# Altium project PCB_Project.PrjPcb
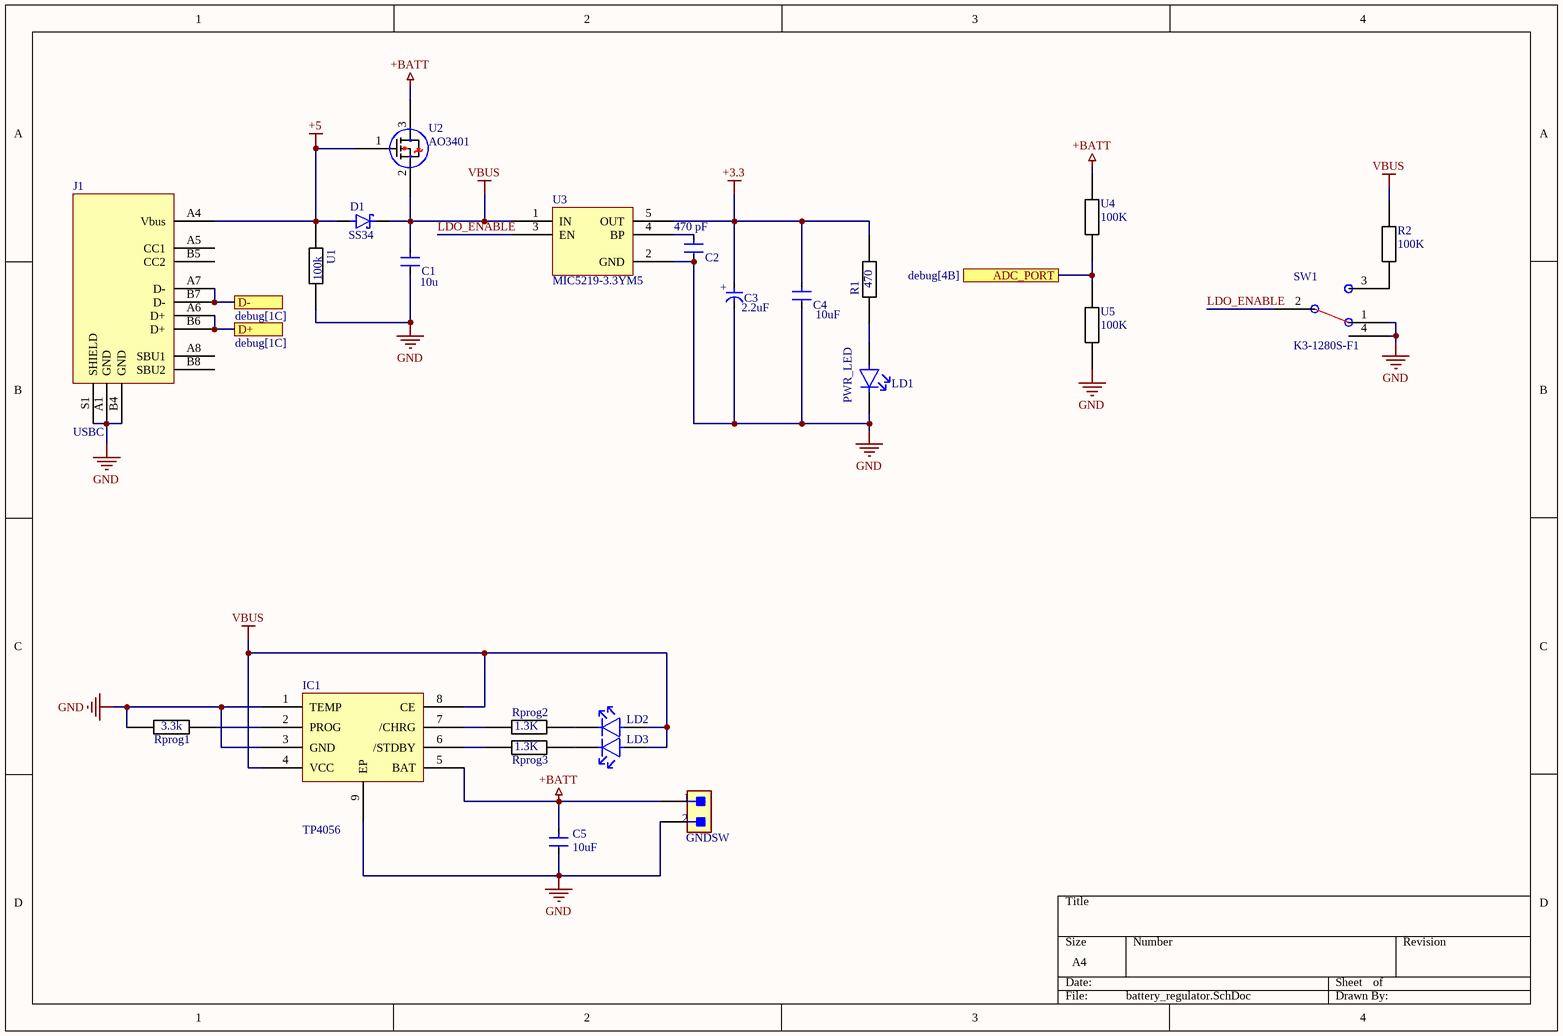
[diagram p0: battery_regulator.SchDoc]
1 sheet, 23 parts. Net scope: flat (ports and power ports of the same name join across sheets).
Board file: PCB_drone.PcbDoc

## Sheet battery_regulator.SchDoc
size A4; SheetNumber: 1; SheetTotal: 3

### Parts
C1  10u  [res0805ph]
C2  470 pF  [res0805ph]
C3  2.2uF  [res0805ph]
C4  10uF  [res0805ph]
C5  10uF  [res0805ph]
D1  SS34  [DIOM7959X265N]
GNDSW  TMM-102-02-L-S  [JST_B2B-XH-A_(LF)(SN)]  (value not drawn)
IC1  TP4056  [SOP127P600X175-9N]
J1  USBC  [SHENZHEN-CHUANGQIN-TECHNOLOGY_CQ-USB-C16PSMT01]
LD1  PWR_LED  [res0805ph]
LD2  APT1608ZGCK  [res0805ph]  (value not drawn)
LD3  APT1608ZGCK  [res0805ph]  (value not drawn)
R1  470  [res0805ph]
R2  100K  [res0805ph]
Rprog1  3.3k  [res0805ph]
Rprog2  1.3K  [res0805ph]
Rprog3  1.3K  [res0805ph]
SW1  K3-1280S-F1  [SW-SMD_K3-1280S-K1]
U1  100k  [res0805ph]
U2  AO3401  [SOT23-3]
U3  MIC5219-3.3YM5  [FP-SOT23-5LD-PL-1-IPC_C]
U4  100K  [res0805ph]
U5  100K  [res0805ph]

### Ports
ADC_PORT (see debug[4B]), D+ (see debug[1C]), D- (see debug[1C])

### Nets
+3.3: C3.2(A) C4.1 R1.2 U3.5(OUT)
+5: D1.A J1.A4(Vbus) U1.2 U2.1
+BATT: C5.1 GNDSW.1 IC1.5(BAT) U2.3 U4.1
GND: C1.2 C2.2 C3.1(C) C4.2 C5.2 GNDSW.2 IC1.1(TEMP) IC1.3(GND) IC1.9(EP) J1.A1(GND) J1.B4(GND) J1.S1(SHIELD) LD1.1(C) Rprog1.2 SW1.1 SW1.4 U1.1 U3.2(GND) U5.2
VBUS: C1.1 D1.C(K) IC1.4(VCC) IC1.8(CE) LD2.2(A) LD3.2(A) R2.1 U2.2 U3.1(IN)
LDO_ENABLE: SW1.2 U3.3(EN)
NetC2_1: C2.1 U3.4(BP)
NetIC1_2: IC1.2(PROG) Rprog1.1
NetIC1_6: IC1.6(/STDBY) Rprog3.2
NetIC1_7: IC1.7(/CHRG) Rprog2.2
NetJ1_A6: J1.A6(D+) J1.B6(D+) ; port D+
NetJ1_A7: J1.A7(D-) J1.B7(D-) ; port D-
NetLD1_2: LD1.2(A) R1.1
NetLD2_1: LD2.1(C) Rprog2.1
NetLD3_1: LD3.1(C) Rprog3.1
NetR2_2: R2.2 SW1.3
NetU4_2: U4.2 U5.1 ; port ADC_PORT

Not connected (* = marked no-connect by the designer): J1 A5(CC1) A8(SBU1) B5(CC2) B8(SBU2)

### Notes on the sheet
- (in symbol Elco+tantaal_1) +

### Library data of the parts
C1 C2 = CER Capacitor_1: Voltage Rating (DC): 35V; Tolerance: 20%; Capacitance: 10uF; Dielectric: X6S; Width: 0.049inch; Thickness: 0.057inch; Voltage Rating: 35V; Min Operating Temperature: -55°C; Case Code (Imperial): 0805; Mount: Surface Mount; Packaging: Tape and Reel; Case/Package: 0805; Max Operating Temperature: 105°C; Length: 0.079inch; Case Code (Metric): 2012
C3 = Elco+tantaal_1: 47uF 6.3V  ±20% 1.1Ω 2917  SMD Tantalum Capacitor; ESR (Equivalent Series Resistance): 1.1R; Dissipation Factor: 6%; Polarity: Polar; Voltage Rating: 6.3V; Width: 0.169inch; Tolerance: 20%; Series: TAJ; Case/Package: 2917; Max Operating Temperature: 125°C; Depth: 4.3mm; Voltage Rating (DC): 6.3V; Package Quantity: 500; Lead Free: Lead Free; Mount: Surface Mount; Length: 0.287inch; Min Operating Temperature: -55°C; Features: General Purpose; Packaging: Tape and Reel; Capacitance: 47uF; Height - Seated (Max): 0.122inch; RoHS Compliant: Yes
C4 C5 = CER Capacitor_1: Voltage Rating (DC): 35V; Tolerance: 20%; Dielectric: X6S; Width: 0.049inch; Thickness: 0.057inch; Voltage Rating: 35V; Min Operating Temperature: -55°C; Case Code (Imperial): 0805; Mount: Surface Mount; Packaging: Tape and Reel; Capacitance: 10uF; Case/Package: 0805; Max Operating Temperature: 105°C; Length: 0.079inch; Case Code (Metric): 2012
GNDSW = Connector 1x2_1: CONN HEADER VERT 2POS 2MM; Max Voltage Rating (AC): 500V; Number of Contacts: 2; Max Current Rating: 3.9A; Gender: Male; Number of Rows: 1; REACH SVHC: No SVHC; Contact Material: Bronze; Length: 4mm; Depth: 1.97mm; Pitch: 2mm; Radiation Hardening: No; Contact Plating: Gold; Min Operating Temperature: -55°C; RoHS Compliant: Yes; Packaging: Bulk; Orientation: Straight; Housing Material: Polymer; Housing Color: Black; Max Operating Temperature: 125°C; Termination: Solder; Lead Free: Lead Free
LD1-LD3 = LED_1: LED GREEN CLEAR CHIP SMD; Forward Voltage: 3.3V; Dominant Wavelength: 525nm; Forward Current: 20mA; Lens Color: Colorless; Viewing Angle: 120°; Luminous Intensity: 350mcd; Lens Transparency: Clear; Color: Green; Max Operating Temperature: 85°C; Case/Package: 0603; Mount: Surface Mount; Min Operating Temperature: -40°C; Case Code (Metric): 1608; Test Current: 20mA; Packaging: Tape and Reel; Width: 0.8mm; Package Quantity: 1; Height: 0.75mm; Length: 1.6mm; Illumination Color: Green; Lead Free: Lead Free; Case Code (Imperial): 0603
R1 R2 Rprog1-Rprog3 U1 U4 U5 = Weerstand_1: RES SMD 5.9K OHM 1% 1/4W 1206; Manufacturer: Yageo; Manufacturer Part Number: AC1206FR-075K9L; Resistance: 5.9KΩ; Power Rating: 0.25W; Voltage Rating: 200V; Automotive Grade: Grade 0; Value: 5.9KΩ; Tolerance: 0.01; Series: AC; Mouser Description: Thick Film Resistors - SMD 1/4W 5.9ohm 1% AEC-Q200; Lead Free: Yes; Octopart: https://octopart.com/ac1206fr-075k9l-yageo-30511161; Automotive: Yes; Temperature Range High: +155°C; ComponentLink2Description: Datasheet; Ipc Land Pattern Name: RESC310160X55; Temperature Range Low: -55°C; Digikey Description: RES SMD 5.9K OHM 1% 1/4W 1206; Device Class L3: Chip SMD Resistors; Device Class L2: Resistors; Category: Res; RoHS: TRUE; Height: 0.65mm; Package: AC1206; Temperature: -55°C to +155°C; ComponentLink2URL: http://www.yageo.com/NewPortal/yageodocoutput?fileName=/pdf/R-Chip/PYu-AC_51_RoHS_L_6.pdf; Device Class L1: Passive Components; Footprint Url: http://www.yageo.com/exep/pages/download/literatures/PYu-R_Mount_10.pdf; Composition: Thick Film
SW1 = Switch
U2 = Transistor